# EAGLE schematic ESP8266_Programmer (EAGLE 9.2.2)
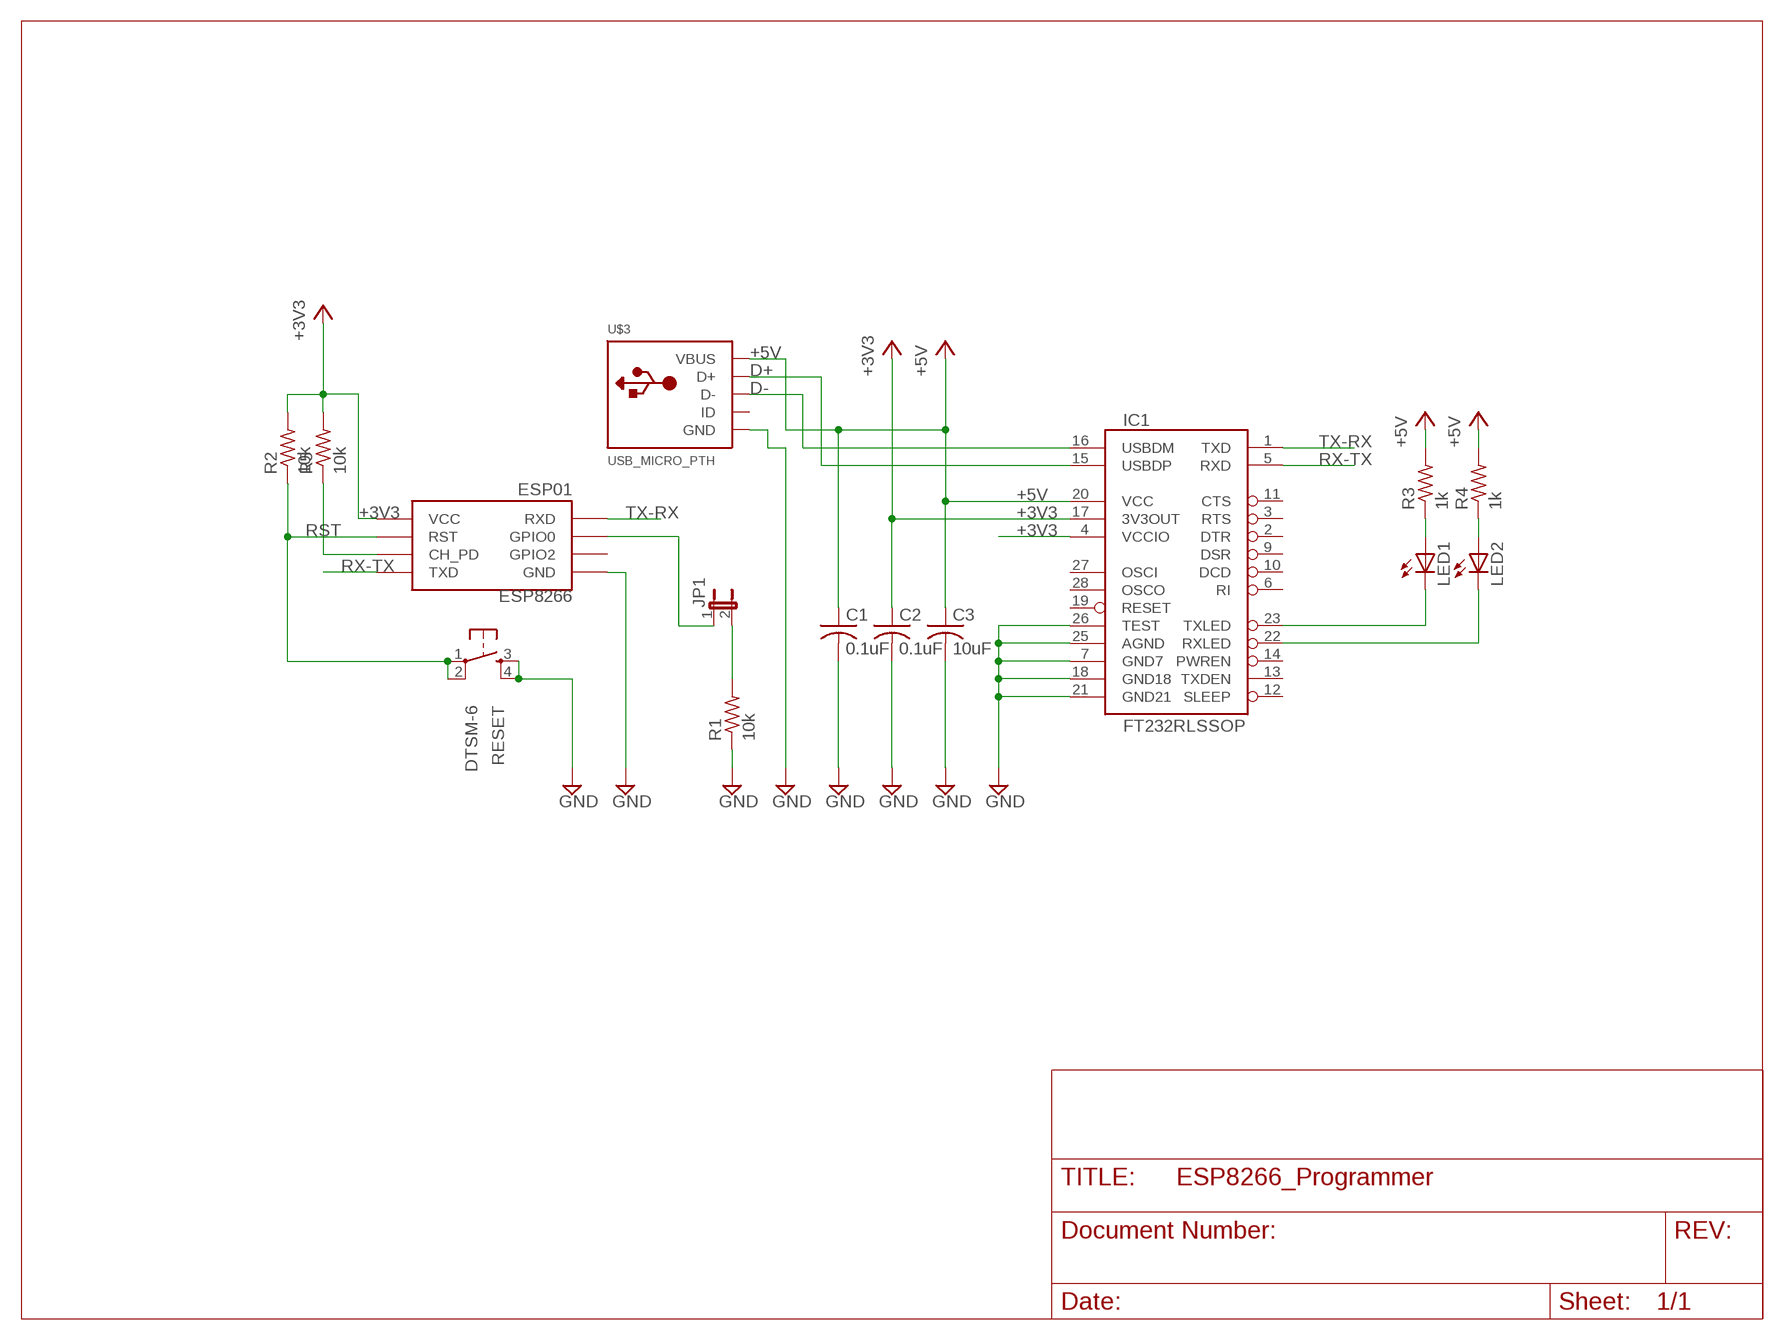
[diagram p0: schematic, sheet 1]

## Parts
C1  0.1uF  C-USC0603  [C0603]
C2  0.1uF  C-USC0603  [C0603]
C3  10uF  C-USC1206  [C1206]
ESP8266  ESP01  [ESP01]
IC1  FT232RLSSOP  [SSOP28DB]
JP1  JUMPER-2PTH  [1X02]
LED1  LEDCHIP-LED0603  [CHIP-LED0603]
LED2  LEDCHIP-LED0603  [CHIP-LED0603]
R1  10k  R-US_R0603  [R0603]
R2  10k  R-US_R0603  [R0603]
R3  1k  R-US_R0603  [R0603]
R4  1k  R-US_R0603  [R0603]
R5  10k  R-US_R0603  [R0603]
RESET  DTSM-6  [DTSM-6]
U$3  USB_MICRO_PTH  [USB_MICRO_PTH]

## Nets
+3V3: C2.1 ESP8266.VCC IC1.4(VCCIO) IC1.17(3V3OUT) R2.2 R5.2
+5V: C1.1 C3.1 IC1.20(VCC) R3.2 R4.2 U$3.1(VBUS)
D+: IC1.15(USBDP) U$3.3(D+)
D-: IC1.16(USBDM) U$3.2(D-)
GND: C1.2 C2.2 C3.2 ESP8266.GND IC1.7(GND7) IC1.18(GND18) IC1.21(GND21) IC1.25(AGND) IC1.26(TEST) R1.1 RESET.3 RESET.4 U$3.5(GND)
N$1: ESP8266.CH_PD R5.1
N$2: JP1.2 R1.2
N$5: ESP8266.GPIO0 JP1.1
N$6: LED1.A R3.1
N$7: LED2.A R4.1
N$8: IC1.23(TXLED) LED1.C
N$9: IC1.22(RXLED) LED2.C
RST: ESP8266.RST R2.1 RESET.1 RESET.2
RX-TX: ESP8266.TX(TXD) IC1.5(RXD)
TX-RX: ESP8266.RX(RXD) IC1.1(TXD)
Unconnected: ESP8266.GPIO2 IC1.2(DTR) IC1.3(RTS) IC1.6(RI) IC1.9(DSR) IC1.10(DCD) IC1.11(CTS) IC1.12(SLEEP) IC1.13(TXDEN) IC1.14(PWREN) IC1.19(RESET) IC1.27(OSCI) IC1.28(OSCO) U$3.4(ID)

## Library data of the parts
C1-C3 = rcl:C-US: CAPACITOR, American symbol; SPICEPREFIX: C
ESP8266 = esp8266:ESP01: ESP8266 Wifi module 01
IC1 = SparkFun:FT232RL: USB UART FT232RL 4th Generation USB UART (USB <-> Serial) Controller. Spark Fun Electronics SKU : COM-00650
JP1 = SparkFun:JUMPER-2: Jumper Basic 0.1" spaced jumper. Use with breakaway headers.
LED1 LED2 = led:LED: LED OSRAM: - CHIPLED LG R971, LG N971, LY N971, LG Q971, LY Q971, LO R971, LY R971 LH N974, LH R974 LS Q976, LO Q976, LY Q976 LO Q996 - Hyper CHIPLED LW Q18S LB Q993, LB Q99A, LB R99A - SideLED LS A670, LO A670, LY A670, LG A670, LP A670 LB A673, LV A673, LT A673, LW A673 LH A674 LY A675 LS A676, LA A676, LO A676, LY A676, LW A676 LS A679, LY A679, LG A679 - Hyper Micro SIDELED® LS Y876, LA Y876, LO Y876, LY Y876 LT Y87S - SmartLED LW L88C, LW L88S LB L89C, LB L89S, LG L890 LS L89K, LO L89K, LY L89K LS L896, LA L896, LO L896, LY L896 - TOPLED LS T670, LO T670, LY T670, LG T670, LP T670 LSG T670, LSP T670, LSY T670, LOP T670, LYG T670 LG T671, LOG T671, LSG T671 LB T673, LV T673, LT T673, LW T673 LH T674 LS T676, LA T676, LO T676, LY T676, LB T676, LH T676, LSB T676, LW T676 LB T67C, LV T67C, LT T67C, LS T67K, LO T67K, LY T67K, LW E67C LS E67B, LA E67B, LO E67B, LY E67B, LB E67C, LV E67C, LT E67C LW T67C LS T679, LY T679, LG T679 LS T770, LO T770, LY T770, LG T770, LP T770 LB T773, LV T773, LT T773, LW T773 LH T774 LS E675, LA E675, LY E675, LS T675 LS T776, LA T776, LO T776, LY T776, LB T776 LHGB T686 LT T68C, LB T68C - Hyper Mini TOPLED® LB M676 - Mini TOPLED Santana® LG M470 LS M47K, LO M47K, LY M47K Source: http://www.osram.convergy.de LUXEON: - LUMILED® LXK2-PW12-R00, LXK2-PW12-S00, LXK2-PW14-U00, LXK2-PW14-V00 LXK2-PM12-R00, LXK2-PM12-S00, LXK2-PM14-U00 LXK2-PE12-Q00, LXK2-PE12-R00, LXK2-PE12-S00, LXK2-PE14-T00, LXK2-PE14-U00 LXK2-PB12-K00, LXK2-PB12-L00, LXK2-PB12-M00, LXK2-PB14-N00, LXK2-PB14-P00, LXK2-PB14-Q00 LXK2-PR12-L00, LXK2-PR12-M00, LXK2-PR14-Q00, LXK2-PR14-R00 LXK2-PD12-Q00, LXK2-PD12-R00, LXK2-PD12-S00 LXK2-PH12-R00, LXK2-PH12-S00 LXK2-PL12-P00, LXK2-PL12-Q00, LXK2-PL12-R00 Source: www.luxeon.com KINGBRIGHT: KA-3528ASYC Source: www.kingbright.com
R1-R5 = rcl:R-US_: RESISTOR, American symbol; SPICEPREFIX: R
RESET = switch-tact:DTSM-6
U$3 = Z:USB_MICRO_PTH